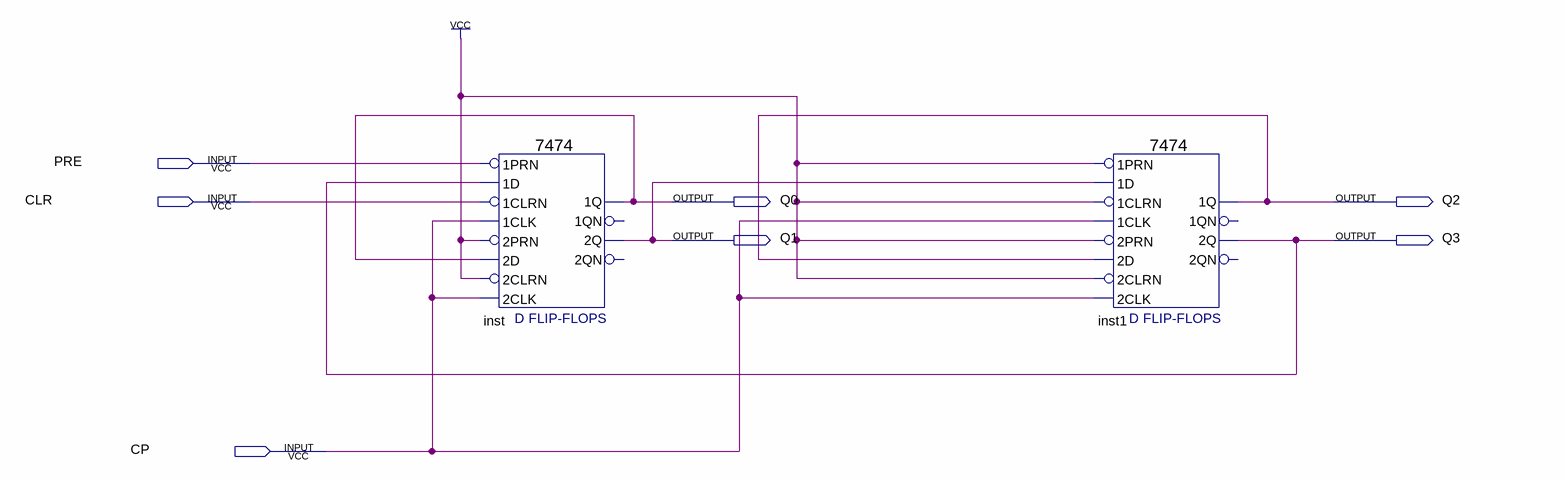
[diagram p0: schematic sheet]
// Quartus schematic 74LS74.bdf as structural Verilog: 2 symbols, 7 pins
module \74LS74  (
  input  PRE,
  input  CLR,
  input  CP,
  output Q0,
  output Q2,
  output Q1,
  output Q3
);

  \7474  inst (
    .\2D (Q0), .\2PRN (1'b1), .\1CLK (CP), .\1D (Q3), .\1PRN (PRE), .\2CLK (CP), .\2CLRN (1'b1),
    .\1CLRN (CLR), .\2Q (Q1), .\1Q (Q0));  // open: 1QN, 2QN
  \7474  inst1 (
    .\2D (Q2), .\2PRN (1'b1), .\1CLK (CP), .\1D (Q1), .\1PRN (1'b1), .\2CLK (CP), .\2CLRN (1'b1),
    .\1CLRN (1'b1), .\2Q (Q3), .\1Q (Q2));  // open: 1QN, 2QN
endmodule
